# Altium schematic sheet MCU.SchDoc: MCU
size 431 x 279 mm; Author: Eric Liu; SheetNumber: 9; SheetTotal: 9
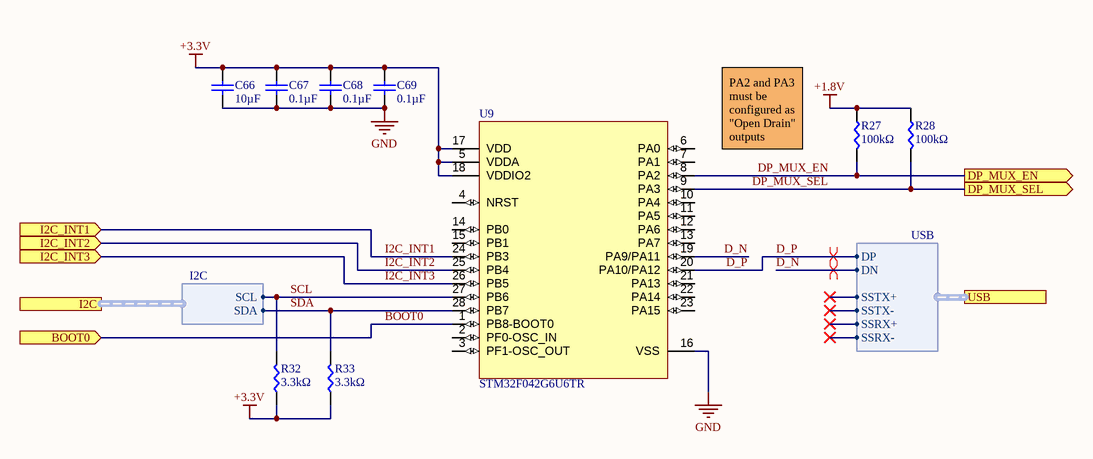
[diagram p0: MCU.SchDoc]

## Parts
C66  value 10µF  [CAP0402]  (hidden comment: CL05A106MQ5NUNC)
C67  value 0.1µF  [CAP0402]  (hidden comment: CC0402KRX5R9BB104)
C68  value 0.1µF  [CAP0402]  (hidden comment: CC0402KRX5R9BB104)
C69  value 0.1µF  [CAP0402]  (hidden comment: CC0402KRX5R9BB104)
R27  value 100kΩ  [RES0402]  (hidden comment: ERJ-2RKF1003X)
R28  value 100kΩ  [RES0402]  (hidden comment: ERJ-2RKF1003X)
R32  value 3.3kΩ  [RES0402]  (hidden comment: ERA-2AEB332X)
R33  value 3.3kΩ  [RES0402]  (hidden comment: ERA-2AEB332X)
U9  STM32F042G6U6TR  [UFQFPN28-4x4mm]

## Ports
BOOT0 (in), DP_MUX_EN (out), DP_MUX_SEL (out), I2C (harness I2C), I2C_INT1 (in), I2C_INT2 (in), I2C_INT3 (in), USB (harness USB)

## Harnesses
USB: DP, DN, SSRX+, SSRX-, SSTX+, SSTX-
I2C: SCL, SDA

## Nets
+1.8V: R27.2 R28.2
+3.3V: C66.2 C67.2 C68.2 C69.2 R32.2 R33.2 U9.5(VDDA) U9.17(VDD) U9.18(VDDIO2)
GND: C66.1 C67.1 C68.1 C69.1 U9.16(VSS)
BOOT0: U9.1(PB8-BOOT0) ; port BOOT0
D_N: U9.19(PA9/PA11) ; port USB.DN
D_P: U9.20(PA10/PA12) ; port USB.DP
DP_MUX_EN: R27.1 U9.8(PA2) ; port DP_MUX_EN
DP_MUX_SEL: R28.1 U9.9(PA3) ; port DP_MUX_SEL
I2C_INT1: U9.24(PB3) ; port I2C_INT1
I2C_INT2: U9.25(PB4) ; port I2C_INT2
I2C_INT3: U9.26(PB5) ; port I2C_INT3
SCL: R32.1 U9.27(PB6) ; port I2C.SCL
SDA: R33.1 U9.28(PB7) ; port I2C.SDA

Not connected (* = marked no-connect by the designer): U9 2(PF0-OSC_IN) 3(PF1-OSC_OUT) 4(NRST) 6(PA0) 7(PA1) 10(PA4) 11(PA5) 12(PA6) 13(PA7) 14(PB0) 15(PB1) 21(PA13) 22(PA14) 23(PA15)

## Layout directives
differential pair: D_N, D_P

## Notes on the sheet
- PA2 and PA3 must be configured as "Open Drain" outputs
- DWG. NO.
- REV.
- SHT.
- THIS DOCUMENT AND THE DATA DISCLOSED HEREIN OR HEREWITH IS THE PROPERTY OF ALTIUM LIMITED AND MAY BE FREELY DISTRIBUTED IN WHOLE. NO RIGHTS ARE RESERVED OR EXPRESS OR IMPLIED WARANTEE GIVEN.
- REVISION
- DESCRIPTION
- DATE
- APPROVED
- ENG:
- APPROVALS
- PROJECT
- DSN:
- CHK:
- REFERENCE DOCUMENTS
- PROJECT REVISION:
- TITLE
- DOCUMENT REVISION:
- DESIGN ITEM:
- BOM:
- FAB DWG:
- PCB DWG:
- ASSY DWG:
- SCALE:
- SIZE
- B
- CAGE CODE
- FILE NAME
- DWG NO.
- SHEET
- OF
- REV

## Library data of the parts
C66 = CL05A106MQ5NUNC: 10 µF ±20% 6.3V Ceramic Capacitor X5R 0402 (1005 Metric); Temperature Coefficient: C0G, NP0; Package: 0402 (1005 Metric); Voltage: 6.3V
C67-C69 = CC0402KRX5R9BB104: 0.1 µF ±10% 50V Ceramic Capacitor X5R 0402 (1005 Metric); Temperature Coefficient: X5R; Package: 0402 (1005 Metric); Voltage: 50V
R27 R28 = ERJ-2RKF1003X: 100 kOhms ±1% 0.1W, 1/10W Chip Resistor 0402 (1005 Metric) Automotive AEC-Q200 Thick Film; Manufacturer 1: Panasonic Electronic Components; Manufacturer Part Number 1: ERJ-2RKF1003X; Supplier Part Number 1: P100KLCT-ND; Supplier 1: Digi-Key; Power Rating: 1/10W
R32 R33 = ERA-2AEB332X: 3.3 kOhms ±0.1% 0.063W, 1/16W Chip Resistor 0402 (1005 Metric) Automotive AEC-Q200 Thin Film; Manufacturer 1: Panasonic Electronic Components; Manufacturer Part Number 1: ERA-2AEB332X; Supplier Part Number 1: P3.3KDCCT-ND; Supplier 1: Digi-Key; Power Rating: 1/16W
U9 = STM32F042G6U6TR: Mainstream Arm Cortex-M0 USB line MCU with 32 Kbytes of Flash memory, 48 MHz CPU, USB, CAN and CEC functions; Manufacturer_Name: STMicroelectronics; Copyright: Copyright (C) 2026 Ultra Librarian. All rights reserved.; Manufacturer_Part_Number: STM32F042G6U6TR; Datasheet: https://www.st.com/resource/en/datasheet/stm32f042c4.pdf; RefDes: RefDes; Type: Type